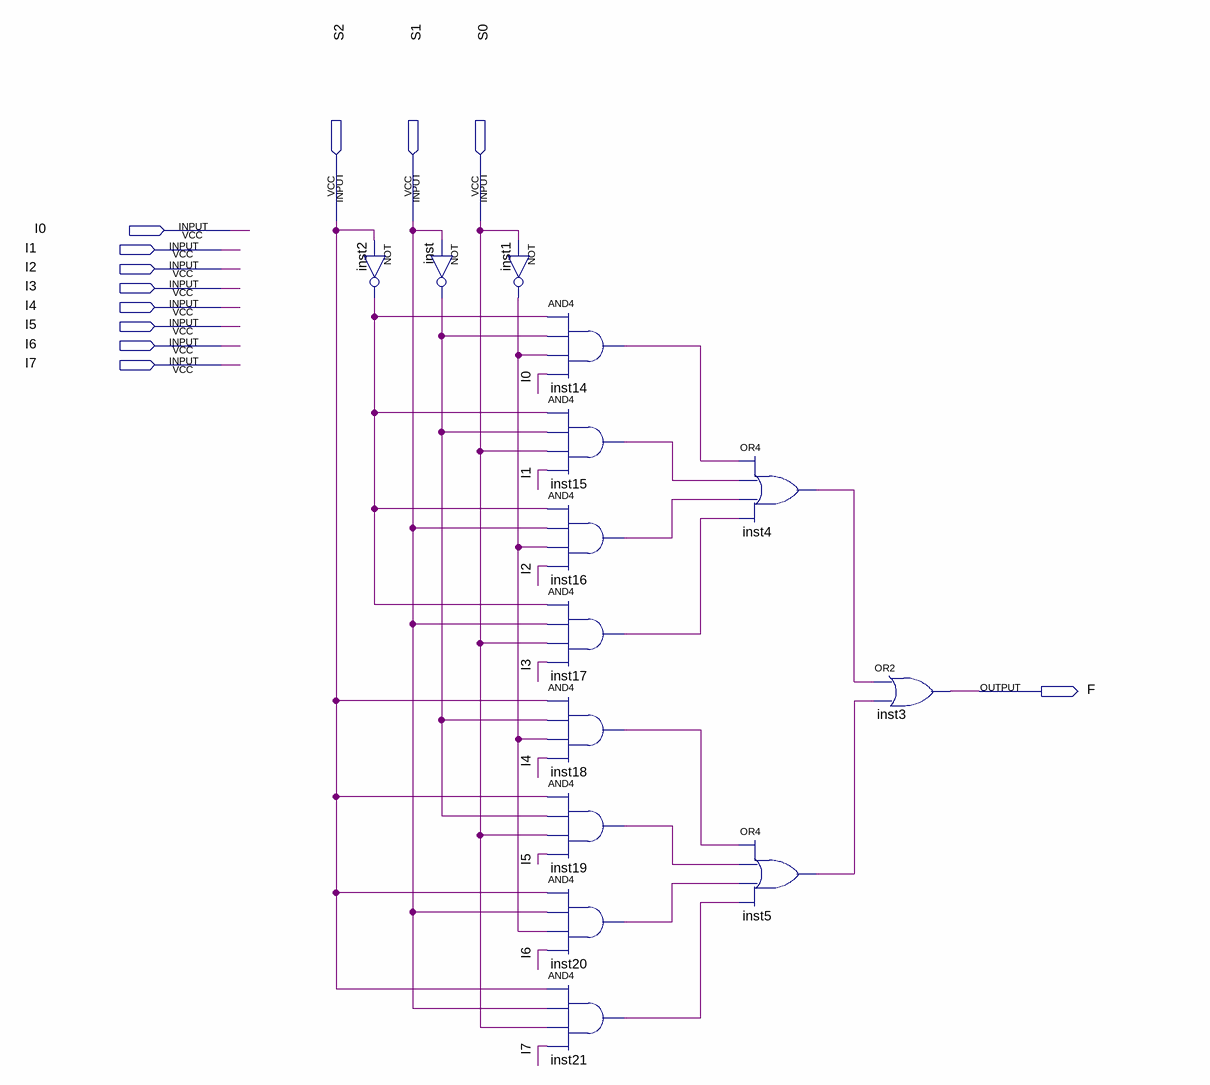
[diagram p0: schematic sheet]
// Quartus schematic Multi81.bdf as structural Verilog: 14 symbols, 12 pins
module Multi81 (
  input  S2,
  input  S1,
  input  S0,
  input  I0,
  input  I1,
  input  I2,
  input  I3,
  input  I4,
  input  I5,
  input  I6,
  input  I7,
  output F
);

  wire inst1_out, inst2_out, inst4_out, inst5_out, inst14_out, inst15_out, inst16_out, inst17_out,
       inst18_out, inst19_out, inst20_out, inst21_out, inst_out;

  not inst2 (inst2_out, S2);
  not inst (inst_out, S1);
  not inst1 (inst1_out, S0);
  and inst14 (inst14_out, inst2_out, inst_out, inst1_out, I0);
  and inst15 (inst15_out, inst2_out, inst_out, S0, I1);
  and inst16 (inst16_out, inst2_out, S1, inst1_out, I2);
  and inst17 (inst17_out, inst2_out, S1, S0, I3);
  and inst18 (inst18_out, S2, inst_out, inst1_out, I4);
  and inst19 (inst19_out, S2, inst_out, S0, I5);
  and inst20 (inst20_out, S2, S1, inst1_out, I6);
  and inst21 (inst21_out, S2, S1, S0, I7);
  or inst4 (inst4_out, inst14_out, inst15_out, inst16_out, inst17_out);
  or inst5 (inst5_out, inst18_out, inst19_out, inst20_out, inst21_out);
  or inst3 (F, inst4_out, inst5_out);
endmodule
